# Altium project hand_logic.PrjPcb (part 3 of 3)
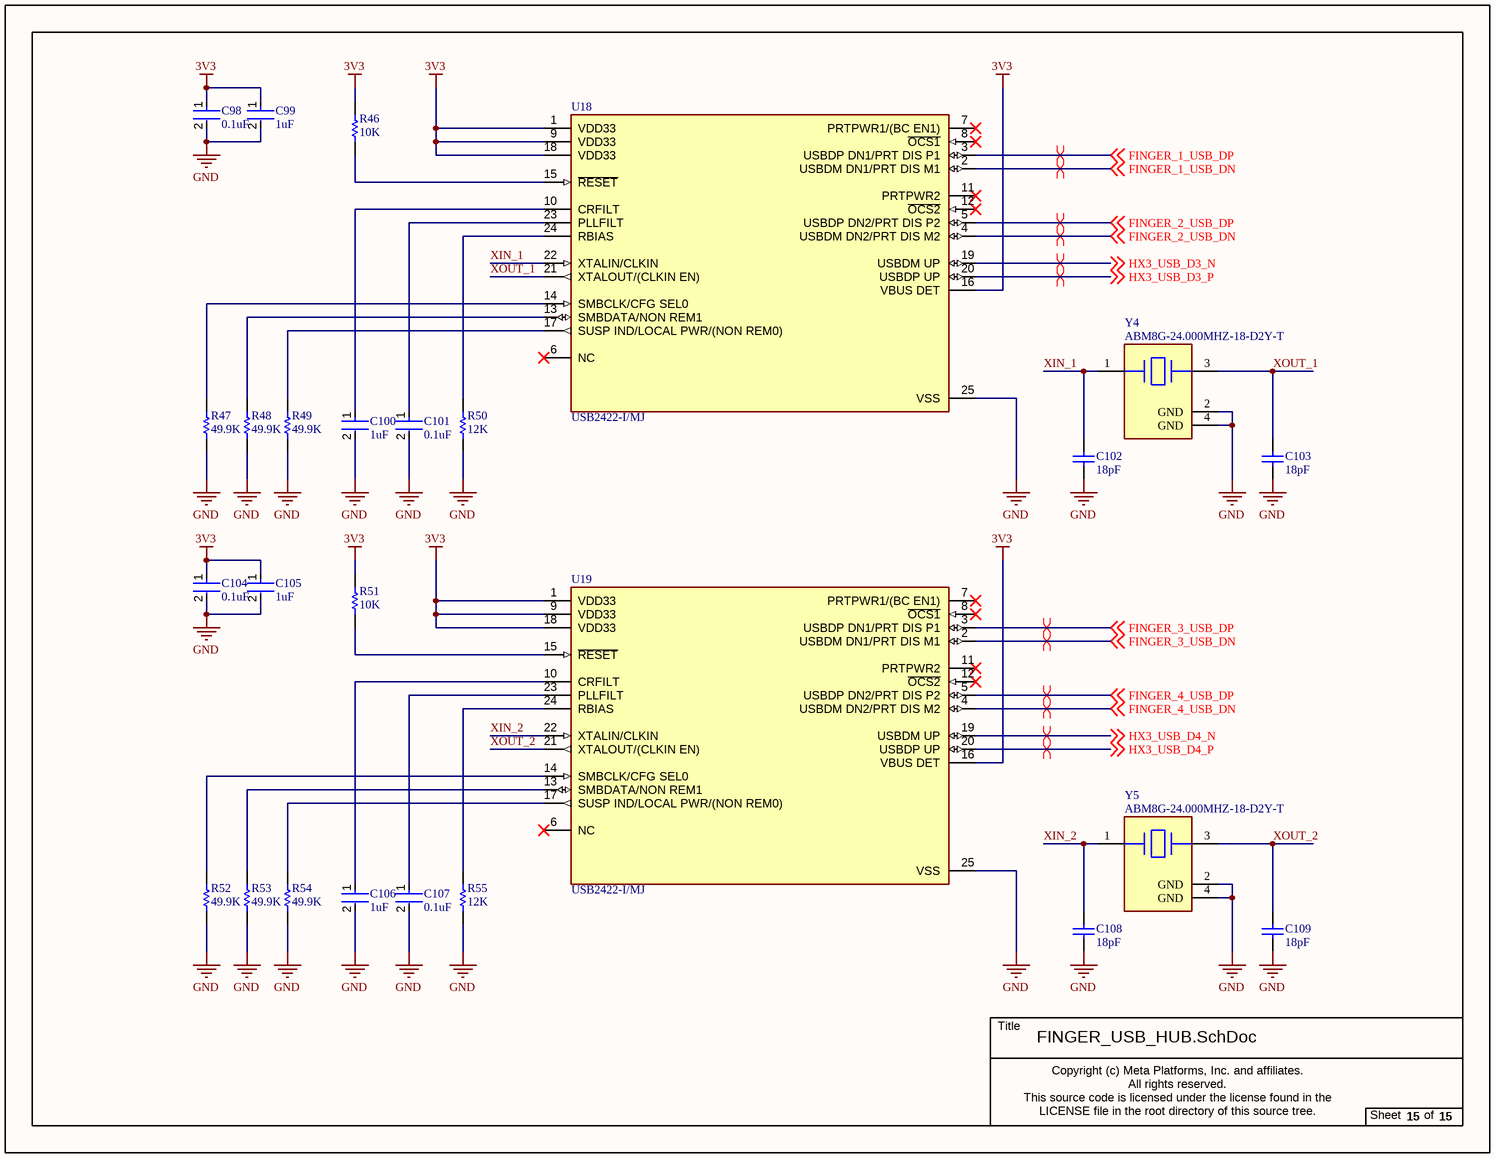
[diagram p15: FINGER_USB_HUB.SchDoc]

## Nets that join several sheets
1V2: USB_HUB (9 pins), USB_POWER (19 pins)
1V2_A: USB_HUB (6 pins), USB_POWER (13 pins)
1V8_FINGER: FINGER_CONNECTORS (6 pins), WALL_POWER (C15.1 L2.2 U6.C1)
1V8_PALM: PALM_CONNECTOR (J4.1 J4.3 J9.1 J9.3), THUMB_CONNECTOR (J6.5), WALL_POWER (C19.1 L4.2 U8.C1)
3V3: PALM_CONNECTOR (R56.2 R57.2), ISP_CONNECTORS (JP1.1 JP2.1), ALLEGRO_CONNECTOR (C111.2 U20.10), HAND_CAN_MCU (20 pins), FINGER_MCU (17 pins), USB_CONNECTOR (C1.1 C6.1 U1.5 U2.5), USB_HUB (6 pins), USB_HUB_SUPPORT (5 pins), USB_POWER (8 pins), FINGER_USB_HUB (14 pins)
3V3_A: USB_HUB (U12.4 U12.56 U12.61 U12.66), USB_POWER (11 pins)
3V3_FINGER: FINGER_CONNECTORS (12 pins), WALL_POWER (C14.1 L1.2 U5.C1)
3V3_PALM: PALM_CONNECTOR (J4.19 J4.21 J9.19 J9.21), THUMB_CONNECTOR (J6.1), WALL_POWER (C18.1 L3.2 U7.C1)
5V: FINGER_CONNECTORS (9 pins), THUMB_CONNECTOR (J6.3), WALL_POWER (16 pins), HAND_CAN_MCU (C31.2 U10.3), USB_HUB (R85.2), USB_HUB_SUPPORT (R39.2), USB_POWER (7 pins), USB_PD_POWER (R7.1 U3.2 U3.7)
GND: FINGER_CONNECTORS (24 pins), PALM_CONNECTOR (32 pins), THUMB_CONNECTOR (J6.2 J6.4), ISP_CONNECTORS (JP1.5 JP2.5), ALLEGRO_CONNECTOR (12 pins), WALL_POWER (16 pins), HAND_CAN_MCU (24 pins), FINGER_MCU (20 pins), USB_CONNECTOR (19 pins), USB_HUB (14 pins), USB_HUB_SUPPORT (7 pins), USB_POWER (47 pins), USD_PD (16 pins), USB_PD_POWER (15 pins), FINGER_USB_HUB (26 pins)
PD_SAFE_5V: USD_PD (Q3.4), USB_PD_POWER (U3.6)
VBUS: USB_CONNECTOR (5 pins), USD_PD (8 pins)
VBUS_PD: ALLEGRO_CONNECTOR (P1.1), USD_PD (Q2.5 Q2.6 U4.11), USB_PD_POWER (5 pins)
WALL_VIN: ALLEGRO_CONNECTOR (P1.3), WALL_POWER (J8.1)
CAN_INTF_H: ALLEGRO_CONNECTOR (J7.5), HAND_CAN_MCU (R20.2 U10.7)
CAN_INTF_L: ALLEGRO_CONNECTOR (J7.6), HAND_CAN_MCU (R21.1 U10.6)
CAN_MCU_RESET: ISP_CONNECTORS (JP2.3), HAND_CAN_MCU (C30.2 R17.2 R71.1 U9.7)
CAN_MCU_SWDCLK: ISP_CONNECTORS (JP2.4), HAND_CAN_MCU (U9.37)
CAN_MCU_SWDIO: ISP_CONNECTORS (JP2.2), HAND_CAN_MCU (U9.34)
CAN_USB_D1_N: HAND_CAN_MCU (U9.32), USB_HUB (U12.63)
CAN_USB_D1_P: HAND_CAN_MCU (U9.33), USB_HUB (U12.62)
CTRL_PWR_EN: ALLEGRO_CONNECTOR (U21.4), FINGER_MCU (U11.8)
FINGER_1_I2C_INT: FINGER_CONNECTORS (J1.6), FINGER_MCU (U11.43)
FINGER_1_SIG_CH1: FINGER_CONNECTORS (J1.8), FINGER_MCU (U11.52)
FINGER_1_USB_DN: FINGER_CONNECTORS (J1.20), FINGER_USB_HUB (U18.2)
FINGER_1_USB_DP: FINGER_CONNECTORS (J1.18), FINGER_USB_HUB (U18.3)
FINGER_2_I2C_INT: FINGER_CONNECTORS (J2.6), FINGER_MCU (U11.44)
FINGER_2_SIG_CH1: FINGER_CONNECTORS (J2.8), FINGER_MCU (U11.51)
FINGER_2_USB_DN: FINGER_CONNECTORS (J2.20), FINGER_USB_HUB (U18.4)
FINGER_2_USB_DP: FINGER_CONNECTORS (J2.18), FINGER_USB_HUB (U18.5)
FINGER_3_I2C_INT: FINGER_CONNECTORS (J3.6), FINGER_MCU (U11.45)
FINGER_3_SIG_CH1: FINGER_CONNECTORS (J3.8), FINGER_MCU (U11.23)
FINGER_3_USB_DN: FINGER_CONNECTORS (J3.20), FINGER_USB_HUB (U19.2)
FINGER_3_USB_DP: FINGER_CONNECTORS (J3.18), FINGER_USB_HUB (U19.3)
FINGER_4_USB_DN: THUMB_CONNECTOR (J6.7), FINGER_USB_HUB (U19.4)
FINGER_4_USB_DP: THUMB_CONNECTOR (J6.8), FINGER_USB_HUB (U19.5)
FINGER_MCU_RESET: ISP_CONNECTORS (JP1.3), FINGER_MCU (C41.2 R26.2 R72.1 U11.7)
FINGER_MCU_SWDCLK: ISP_CONNECTORS (JP1.4), FINGER_MCU (U11.49)
FINGER_MCU_SWDIO: ISP_CONNECTORS (JP1.2), FINGER_MCU (U11.46)
FINGER_MCU_SWDO: ISP_CONNECTORS (JP1.6), FINGER_MCU (U11.55)
HX3_I2C_SCL: USB_HUB (U12.32), USB_HUB_SUPPORT (R43.1 U15.6)
HX3_I2C_SDA: USB_HUB (U12.33), USB_HUB_SUPPORT (R44.1 U15.5)
HX3_USB_D3_N: USB_HUB (U12.64), FINGER_USB_HUB (U18.19)
HX3_USB_D3_P: USB_HUB (U12.65), FINGER_USB_HUB (U18.20)
HX3_USB_D4_N: USB_HUB (U12.68), FINGER_USB_HUB (U19.19)
HX3_USB_D4_P: USB_HUB (U12.67), FINGER_USB_HUB (U19.20)
MCU_FINGER_FMPI2C1_SCL: PALM_CONNECTOR (J4.2 J9.2 R56.1), THUMB_CONNECTOR (J6.9), ALLEGRO_CONNECTOR (U20.9), FINGER_MCU (U11.37), USD_PD (U4.13)
MCU_FINGER_FMPI2C1_SDA: PALM_CONNECTOR (J4.6 J9.6 R57.1), THUMB_CONNECTOR (J6.10), ALLEGRO_CONNECTOR (U20.8), FINGER_MCU (U11.38), USD_PD (U4.12)
MCU_FINGER_I2C1_SCL: FINGER_CONNECTORS (J1.2 R61.1), FINGER_MCU (U11.58)
MCU_FINGER_I2C1_SDA: FINGER_CONNECTORS (J1.4 R62.1), FINGER_MCU (U11.59)
MCU_FINGER_I2C2_SCL: FINGER_CONNECTORS (J2.2 R63.1), FINGER_MCU (U11.29)
MCU_FINGER_I2C2_SDA: FINGER_CONNECTORS (J2.4 R64.1), FINGER_MCU (U11.53)
MCU_FINGER_I2C3_SCL: FINGER_CONNECTORS (J3.2 R65.1), FINGER_MCU (U11.41)
MCU_FINGER_I2C3_SDA: FINGER_CONNECTORS (J3.4 R66.1), FINGER_MCU (U11.56)
MCU_USB_HS_D2_N: FINGER_MCU (U11.35), USB_HUB (U12.59)
MCU_USB_HS_D2_P: FINGER_MCU (U11.36), USB_HUB (U12.60)
MH_MCU_CAN_RESET: HAND_CAN_MCU (R70.2 U9.12), FINGER_MCU (U11.9)
PALM_RESET: PALM_CONNECTOR (J4.12 J9.12), THUMB_CONNECTOR (J6.6), FINGER_MCU (U11.39)
SUSPEND: USB_HUB (U12.20), USB_HUB_SUPPORT (R40.2)
USB_CC1: USB_CONNECTOR (J5.A5 R2.2), USD_PD (C115.1 U4.15)
USB_CC2: USB_CONNECTOR (J5.B5 R1.2), USD_PD (C114.1 U4.14)
USB_D_N: USB_CONNECTOR (J5.A7 J5.B7), USB_HUB (U12.58)
USB_D_P: USB_CONNECTOR (J5.A6 J5.B6), USB_HUB (U12.57)
USB_MUX_FLIP: USB_CONNECTOR (U1.4 U2.4), USD_PD (R4.2 U4.10)
USB_RX_N: USB_CONNECTOR (U2.3), USB_HUB (U12.8)
USB_RX_P: USB_CONNECTOR (U2.2), USB_HUB (U12.9)
USB_TX_N: USB_CONNECTOR (C3.2), USB_HUB (U12.5)
USB_TX_P: USB_CONNECTOR (C2.2), USB_HUB (U12.6)

## Assembly variants
Populated Configuration: not fitted C9 R1 R2 R5 R16 R17 R20 R21 R24 R26 R28 R31 R41
New Variant: all parts fitted